# EAGLE design LED_PCB_3SMD (EAGLE 8.7.1)
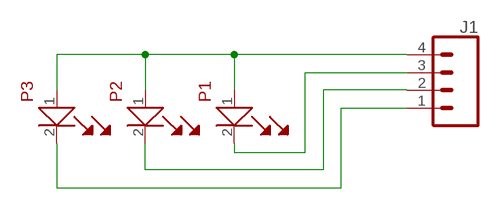
[diagram p0: schematic, sheet 1]

## Parts
J1  CONN_04LONGPADS  [1X04_LONGPADS]
P1  OSRAM-LED  [SMD-2]
P2  OSRAM-LED  [SMD-2]
P3  OSRAM-LED  [SMD-2]

## Nets
N$1: J1.4 P1.1(ANODE) P2.1(ANODE) P3.1(ANODE)
N$2: J1.3 P1.2(CATHODE)
N$3: J1.2 P2.2(CATHODE)
N$5: J1.1 P3.2(CATHODE)

## Library data of the parts
J1 = SparkFun-Connectors:CONN_04: Multi connection point. Often used as Generic Header-pin footprint for 0.1 inch spaced/style header connections On any of the 0.1 inch spaced packages, you can populate with these: Break Away Headers - Straight <https://www.sparkfun.com/products/116> (PRT-00116) Break Away Male Headers - Right Angle <https://www.sparkfun.com/products/553> (PRT-00553) Female Headers <https://www.sparkfun.com/products/115> (PRT-00115) Break Away Headers - Machine Pin <https://www.sparkfun.com/products/117> (PRT-00117) Break Away Female Headers - Swiss Machine Pin <https://www.sparkfun.com/products/743> (PRT-00743) For SCREWTERMINALS and SPRING TERMINALS visit here: Screw Terimnals on SparkFun.com <https://www.sparkfun.com/search/results?term=Screw+Terminals> (5mm/3.5mm/2.54mm spacing) This device is also useful as a general connection point to wire up your design to another part of your project. Our various solder wires solder well into these plated through hole pads. Hook-Up Wire - Assortment (Stranded, 22 AWG) <https://www.sparkfun.com/products/11375> (PRT-11375) Hook-Up Wire - Assortment (Solid Core, 22 AWG) <https://www.sparkfun.com/products/11367> (PRT-11367) View the entire wire category on our website here <https://www.sparkfun.com/categories/141> Special notes: Molex polarized connector foot print use with SKU : PRT-08231 with associated crimp pins and housings. 1MM SMD Version SKU: PRT-10208; PROD_ID: CONN-09696
P1-P3 = OWN:OSRAM-LED: Osram Leds

## Net classes
0 default: width 0.508 mm, clearance 0.127 mm

## Board
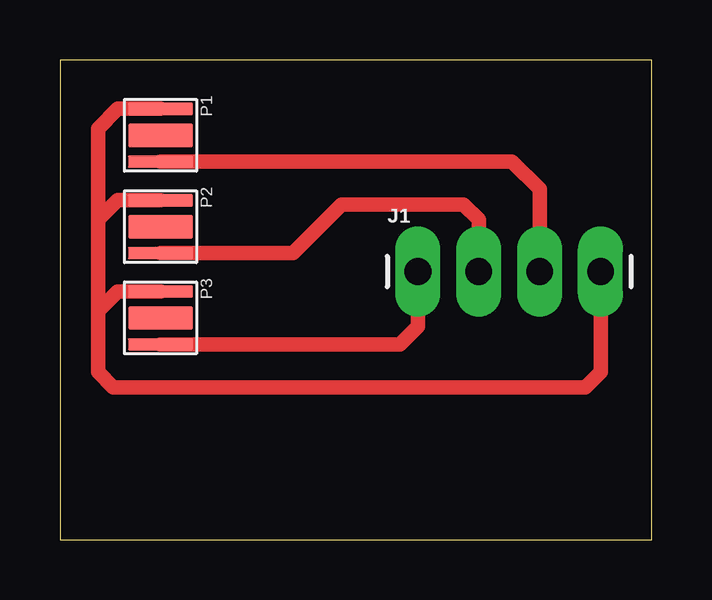
[diagram p1: board, top side]

Size 24.68 x 20 mm. Coordinates in mm from the lower left corner, seen from the top.
Outline: 0,0 24.68,0 24.68,20 0,20 0,0
Copper layers (1*16): Top 0.035mm / dielectric 1.5mm / Bottom 0.035mm
Design rules "default": minimum track width 6mil, minimum drill 0.35mm, track to track 6mil, track to pad 6mil, pad to pad 6mil, via to via 6mil, smd to smd 6mil, copper to edge 40mil, drill to drill 6mil, minimum pad ring 10mil, minimum via ring 8mil, stop-mask expansion 4mil, vias tented up to drill 0mil, thermal gap 10mil

### Footprints (pad centres in the part's own frame; a part is rotated, then mirrored left to right if it is on the bottom)
1X04_LONGPADS = drill 1.118 pad 1.88 long: 1 0,0; 2 2.54,0; 3 5.08,0; 4 7.62,0
SMD-2 = smd 0.5 x 2.7: 1 -1.1,0; 2 1.1,0 | smd 1 x 2.7: P$3 0,0

### Placement (x,y rotation side)
J1  14.92,11.18 0 top
P1  4.19,16.86 270 top
P2  4.19,13.05 270 top
P3  4.19,9.24 270 top

### Tracks (layer width: path | path; a pad name or v marks a point on that pad's centre or on a via)
N$1
  Top 0.61: J1.4 22.54,6.99 21.91,6.35 2.22,6.35 1.59,6.99 1.59,9.53 | P1.1 2.4,17.96 1.59,17.14 1.59,13.34 | 1.59,9.53 1.59,13.34 | P2.1 2.4,14.15 1.59,13.34 | P3.1 2.4,10.34 1.59,9.53
N$2
  Top 0.61: J1.3 20,14.61 18.85,15.76 P1.2
N$3
  Top 0.61: J1.2 17.46,13.33 17.46,13.34 16.83,13.97 11.75,13.97 9.73,11.95 P2.2
N$5
  Top 0.61: J1.1 14.92,10.16 14.92,8.89 14.17,8.14 P3.2